# EAGLE schematic GasSensorCentral_v1.0 (EAGLE 7.2.0)
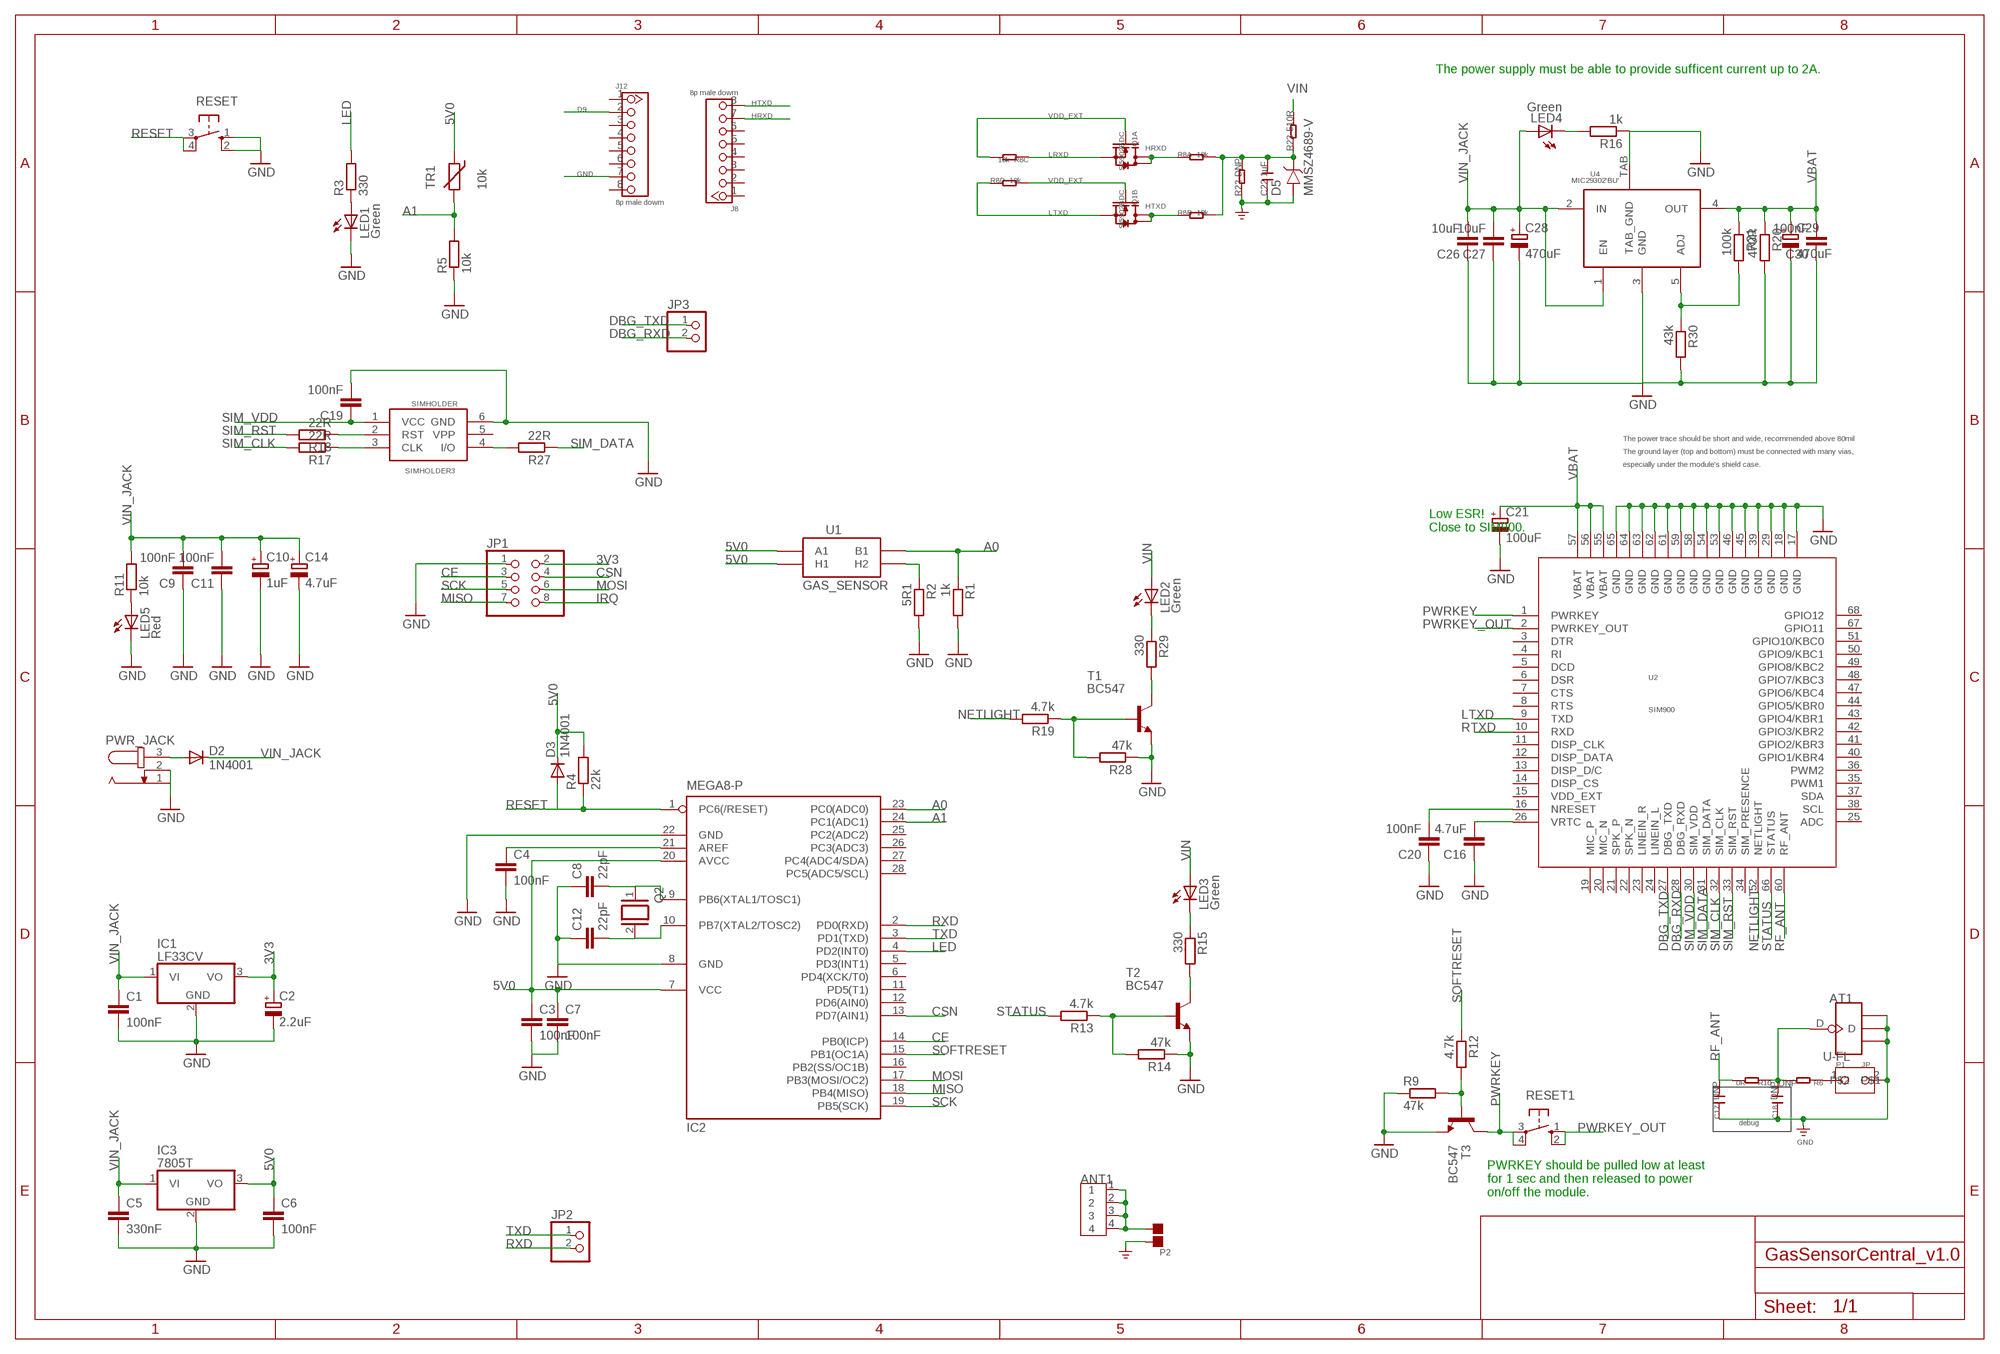
[diagram p0: schematic, sheet 1]

## Parts
ANT1  ANTENNA-SMA-IPX  [SMA-TO-IPX]
AT1  U-FL  ANTENNA-U-FL  [4P-U-FL]
C1  100nF  C-EU025-025X050  [C025-025X050]
C2  2.2uF  CPOL-EUE2.5-5  [E2,5-5]
C3  100nF  C-EU025-025X050  [C025-025X050]
C4  100nF  C-EU025-025X050  [C025-025X050]
C5  330nF  C-EU025-025X050  [C025-025X050]
C6  100nF  C-EU025-025X050  [C025-025X050]
C7  100nF  C-EU025-025X050  [C025-025X050]
C8  22pF  C-EU025-025X050  [C025-025X050]
C9  100nF  C-EU025-025X050  [C025-025X050]
C10  1uF  CPOL-EUE2.5-5  [E2,5-5]
C11  100nF  C-EU025-025X050  [C025-025X050]
C12  22pF  C-EU025-025X050  [C025-025X050]
C14  4.7uF  CPOL-EUE2.5-5  [E2,5-5]
C16  4.7uF  C-EU025-025X050  [C025-025X050]
C17  DNP  C-0402  [0402]
C18  DNP  C-0402  [0402]
C19  100nF  C-EU025-025X050  [C025-025X050]
C20  100nF  C-EU025-025X050  [C025-025X050]
C21  100uF  CPOL-EUE2.5-5  [E2,5-5]
C22  1uF  C-0603  [0603]
C26  10uF  C-EU025-025X050  [C025-025X050]
C27  10uF  C-EU025-025X050  [C025-025X050]
C28  470uF  CPOL-EUE2.5-5  [E2,5-5]
C29  470uF  CPOL-EUE2.5-5  [E2,5-5]
C30  100nF  C-EU025-025X050  [C025-025X050]
D2  1N4001  1N4004  [DO41-10]
D3  1N4001  1N4004  [DO41-10]
D5  MMSZ4689-V  D-VOL'MMSZ4681'  [SOD123-2.7X1.6]
IC1  LF33CV  7805T  [TO220H]
IC2  MEGA8-P  [DIL28-3]
IC3  7805T  [TO220H]
J8  8p male dowm  CK_1X8DD  [CK_1X8]
J12  8p male dowm  CK_1X8DD  [CK_1X8]
JP1  PINHD-2X4  [2X04]
JP2  PINHD-1X2/90  [1X02/90]
JP3  PINHD-1X2/90  [1X02/90]
LED1  Green  LED3MM  [LED3MM]
LED2  Green  LED3MM  [LED3MM]
LED3  Green  LED3MM  [LED3MM]
LED4  Green  LED3MM  [LED3MM]
LED5  Red  LED3MM  [LED3MM]
P1  JP  [JP]
P2  PAD-JUMPER-2P  [2P-SMD-1.78X1.27]
PWR_JACK  JACK-PLUG0  [SPC4077]
Q1  Si5902BDC  010-DUAL-N-MOSFET_1206-8  [1206-8]
Q2  XTAL/S  [QS]
R1  1k  R-EU_0207/10  [0207/10]
R2  5R1  R-EU_0207/10  [0207/10]
R3  330  R-EU_0207/10  [0207/10]
R4  22k  R-EU_0207/10  [0207/10]
R5  10k  R-EU_0207/10  [0207/10]
R6  DNP  R-0402  [0402]
R8  10k  R-4R-1206  [1206-8-3.3X2.4]
R9  47k  R-EU_0207/10  [0207/10]
R10  0R  R-0402  [0402]
R11  10k  R-EU_0207/10  [0207/10]
R12  4.7k  R-EU_0207/10  [0207/10]
R13  4.7k  R-EU_0207/10  [0207/10]
R14  47k  R-EU_0207/10  [0207/10]
R15  330  R-EU_0207/10  [0207/10]
R16  1k  R-EU_0207/10  [0207/10]
R17  22R  R-EU_0207/10  [0207/10]
R18  22R  R-EU_0207/10  [0207/10]
R19  4.7k  R-EU_0207/10  [0207/10]
R20  470R  R-EU_0207/10  [0207/10]
R21  100k  R-EU_0207/10  [0207/10]
R22  DNP  R-0603  [0603]
R23  510R  R-0603  [0603]
R27  22R  R-EU_0207/10  [0207/10]
R28  47k  R-EU_0207/10  [0207/10]
R29  330  R-EU_0207/10  [0207/10]
R30  43k  R-EU_0207/10  [0207/10]
RESET  10-XX  [B3F-10XX]
RESET1  10-XX  [B3F-10XX]
SIMHOLDER  SIMHOLDER3  [SIMHOLDER3]
T1  BC547  [TO92]
T2  BC547  [TO92]
T3  BC547  [TO92]
TR1  10k  THERMISTOR_R-2,5  [RS-2,5]
U1  GAS_SENSOR  [MQ-3]
U2  SIM900  [SIM900]
U4  MIC29302'BU'  [TO-263]

## Nets
3V3: C2.+ IC1.3(VO) JP1.2
5V0: C3.1 C6.1 C7.1 D3.C IC2.7(VCC) IC2.20(AVCC) IC3.3(VO) R4.2 TR1.1 U1.A1 U1.HA(H1)
A0: IC2.23(PC0(ADC0)) R1.1 U1.B1
A1: IC2.24(PC1(ADC1)) R5.2 TR1.2
CE: IC2.14(PB0(ICP)) JP1.3
CSN: IC2.13(PD7(AIN1)) JP1.4
D9: J12.2
DBG_RXD: JP3.2 U2.28(DBG_RXD)
DBG_TXD: JP3.1 U2.27(DBG_TXD)
GND: AT1.GND1 AT1.GND2 AT1.GND3 C1.2 C2.- C3.2 C4.2 C5.2 C6.2 C7.2 C8.1 C9.1 C10.- C11.1 C12.1 C14.- C16.1 C17.1 C18.1 C19.2 C20.1 C21.- C22.1 C26.1 C27.1 C28.- C29.- C30.1 D5.1 IC1.2(GND) IC2.8(GND) IC2.22(GND) IC3.2(GND) J12.7 JP1.1 LED1.K(C) LED5.K(C) P1.2 P2.2 PWR_JACK.1 PWR_JACK.2 R1.2 R2.2 R5.1 R9.1 R14.1 R16.1 R20.2 R22.1 R28.1 R30.2 RESET.1(S) RESET.2(S1) SIMHOLDER.6(GND) T1.1(E) T2.1(E) T3.1(E) U2.17(GND) U2.18(GND) U2.29(GND) U2.39(GND) U2.45(GND) U2.46(GND) U2.53(GND) U2.54(GND) U2.58(GND) U2.59(GND) U2.61(GND) U2.62(GND) U2.63(GND) U2.64(GND) U2.65(GND) U4.3(GND) U4.TAB(TAB_GND)
HRXD: J8.7 Q1.7(A:D) Q1.8(A:D) R8.1
HTXD: J8.8 Q1.5(B:D) Q1.6(B:D) R8.2
IRQ: JP1.8
LED: IC2.4(PD2(INT0)) R3.2
LRXD: Q1.1(A:S) R8.3
LTXD: Q1.3(B:S) R8.4 U2.9(TXD)
MISO: IC2.18(PB4(MISO)) JP1.7
MOSI: IC2.17(PB3(MOSI/OC2)) JP1.6
N$1: C4.1 IC2.21(AREF)
N$3: R2.1 U1.HB(H2)
N$4: D2.A PWR_JACK.3
N$5: LED1.A R3.1
N$6: R27.2 SIMHOLDER.4(I/O)
N$7: LED2.K(C) R29.1
N$8: R29.2 T1.3(C)
N$9: R13.1 R14.2 T2.2(B)
N$10: LED5.A R11.1
N$11: LED3.K(C) R15.1
N$12: R15.2 T2.3(C)
N$13: C20.2 U2.16(NRESET)
N$14: R9.2 R12.2 T3.2(B)
N$15: R19.1 R28.2 T1.2(B)
N$16: R21.2 R30.1 U4.5(ADJ)
N$17: C16.2 U2.26(VRTC)
N$21: AT1.D C18.2 R6.2 R10.1
N$22: P1.1 R6.1
N$23: LED4.K(C) R16.2
N$24: R18.1 SIMHOLDER.2(RST)
N$25: R17.1 SIMHOLDER.3(CLK)
N$29: C8.2 IC2.9(PB6(XTAL1/TOSC1)) Q2.1
N$35: C12.2 IC2.10(PB7(XTAL2/TOSC2)) Q2.2
N$38: C22.2 D5.2 R8.7 R8.8 R22.2 R23.1
N$39: ANT1.1 ANT1.2 ANT1.3 ANT1.4 P2.1
NETLIGHT: R19.2 U2.52(NETLIGHT)
PWRKEY: RESET1.3(P) RESET1.4(P1) T3.3(C) U2.1(PWRKEY)
PWRKEY_OUT: RESET1.1(S) RESET1.2(S1) U2.2(PWRKEY_OUT)
RESET: D3.A IC2.1(PC6(/RESET)) R4.1 RESET.3(P) RESET.4(P1)
RF_ANT: C17.2 R10.2 U2.60(RF_ANT)
RTXD: U2.10(RXD)
RXD: IC2.2(PD0(RXD)) JP2.2
SCK: IC2.19(PB5(SCK)) JP1.5
SIM_CLK: R17.2 U2.32(SIM_CLK)
SIM_DATA: R27.1 U2.31(SIM_DATA)
SIM_RST: R18.2 U2.33(SIM_RST)
SIM_VDD: C19.1 SIMHOLDER.1(VCC) U2.30(SIM_VDD)
SOFTRESET: IC2.15(PB1(OC1A)) R12.1
STATUS: R13.2 U2.66(STATUS)
TXD: IC2.3(PD1(TXD)) JP2.1
VBAT: C21.+ C29.+ C30.2 R20.1 R21.1 U2.55(VBAT) U2.56(VBAT) U2.57(VBAT) U4.4(OUT)
VDD_EXT: Q1.2(A:G) Q1.4(B:G) R8.5 R8.6
VIN: LED2.A LED3.A R23.2
VIN_JACK: C1.1 C5.1 C9.2 C10.+ C11.2 C14.+ C26.2 C27.2 C28.+ D2.C IC1.1(VI) IC3.1(VI) LED4.A R11.2 U4.1(EN) U4.2(IN)
Unconnected: IC2.5(PD3(INT1)) IC2.6(PD4(XCK/T0)) IC2.11(PD5(T1)) IC2.12(PD6(AIN0)) IC2.16(PB2(SS/OC1B)) IC2.25(PC2(ADC2)) IC2.26(PC3(ADC3)) IC2.27(PC4(ADC4/SDA)) IC2.28(PC5(ADC5/SCL)) J8.1 J8.2 J8.3 J8.4 J8.5 J8.6 J12.1 J12.3 J12.4 J12.5 J12.6 J12.8 SIMHOLDER.5(VPP) U2.3(DTR) U2.4(RI) U2.5(DCD) U2.6(DSR) U2.7(CTS) U2.8(RTS) U2.11(DISP_CLK) U2.12(DISP_DATA) U2.13(DISP_D/C) U2.14(DISP_CS) U2.15(VDD_EXT) U2.19(MIC_P) U2.20(MIC_N) U2.21(SPK_P) U2.22(SPK_N) U2.23(LINEIN_R) U2.24(LINEIN_L) U2.25(ADC) U2.34(SIM_PRESENCE) U2.35(PWM1) U2.36(PWM2) U2.37(SDA) U2.38(SCL) U2.40(GPIO1/KBR4) U2.41(GPIO2/KBR3) U2.42(GPIO3/KBR2) U2.43(GPIO4/KBR1) U2.44(GPIO5/KBR0) U2.47(GPIO6/KBC4) U2.48(GPIO7/KBC3) U2.49(GPIO8/KBC2) U2.50(GPIO9/KBC1) U2.51(GPIO10/KBC0) U2.67(GPIO11) U2.68(GPIO12)

## Notes on the sheet
- The power supply must be able to provide sufficent current up to 2A.
- The power trace should be short and wide, recommended above 80mil
- The ground layer (top and bottom) must be connected with many vias,
- especially under the module's shield case.
- Low ESR!
  Close to SIM900.
- debug
- PWRKEY should be pulled low at least 
  for 1 sec and then released to power 
  on/off the module.

## Library data of the parts
ANT1 = Connector:ANTENNA-SMA-IPX
AT1 = Connector:ANTENNA-U-FL
C1 C3-C9 C11 C12 C16 C19 C20 C26 C27 C30 = rcl:C-EU: CAPACITOR, European symbol
C2 C10 C14 C21 C28 C29 = rcl:CPOL-EU: POLARIZED CAPACITOR, European symbol
C17 C18 C22 = discrete:C*: Ceramic Capacitors
D2 D3 = diode:1N4004: DIODE general purpose rectifier, 1 A
D5 = template:D-VOL
IC1 IC3 = linear:78*: Positive VOLTAGE REGULATOR Source: http://cache.national.com/ds/LM/LM78L05.pdf http://www.fairchildsemi.com/ds/LM/LM7805.pdf
IC2 = atmel:MEGA8-P: MICROCONTROLLER 8 Kbytes FLASH, 1 kbytes SRAM, 512 bytes EEPROM, USART, 4-channel 10 bit ADC, 2-channel 8 bit ADC Pin compatible with Atmega48, ATMega88, ATMega168 Source: avr.lbr; OC_FARNELL: unknown; OC_NEWARK: unknown
J8 J12 = CONNECTER:CK_1X8
JP1 = pinhead:PINHD-2X4: PIN HEADER
JP2 JP3 = pinhead:PINHD-1X2: PIN HEADER
LED1-LED5 = led:LED: LED OSRAM: - CHIPLED LG R971, LG N971, LY N971, LG Q971, LY Q971, LO R971, LY R971 LH N974, LH R974 LS Q976, LO Q976, LY Q976 LO Q996 - Hyper CHIPLED LW Q18S LB Q993, LB Q99A, LB R99A - SideLED LS A670, LO A670, LY A670, LG A670, LP A670 LB A673, LV A673, LT A673, LW A673 LH A674 LY A675 LS A676, LA A676, LO A676, LY A676, LW A676 LS A679, LY A679, LG A679 - Hyper Micro SIDELED® LS Y876, LA Y876, LO Y876, LY Y876 LT Y87S - SmartLED LW L88C, LW L88S LB L89C, LB L89S, LG L890 LS L89K, LO L89K, LY L89K LS L896, LA L896, LO L896, LY L896 - TOPLED LS T670, LO T670, LY T670, LG T670, LP T670 LSG T670, LSP T670, LSY T670, LOP T670, LYG T670 LG T671, LOG T671, LSG T671 LB T673, LV T673, LT T673, LW T673 LH T674 LS T676, LA T676, LO T676, LY T676, LB T676, LH T676, LSB T676, LW T676 LB T67C, LV T67C, LT T67C, LS T67K, LO T67K, LY T67K, LW E67C LS E67B, LA E67B, LO E67B, LY E67B, LB E67C, LV E67C, LT E67C LW T67C LS T679, LY T679, LG T679 LS T770, LO T770, LY T770, LG T770, LP T770 LB T773, LV T773, LT T773, LW T773 LH T774 LS E675, LA E675, LY E675, LS T675 LS T776, LA T776, LO T776, LY T776, LB T776 LHGB T686 LT T68C, LB T68C - Hyper Mini TOPLED® LB M676 - Mini TOPLED Santana® LG M470 LS M47K, LO M47K, LY M47K Source: http://www.osram.convergy.de LUXEON: - LUMILED® LXK2-PW12-R00, LXK2-PW12-S00, LXK2-PW14-U00, LXK2-PW14-V00 LXK2-PM12-R00, LXK2-PM12-S00, LXK2-PM14-U00 LXK2-PE12-Q00, LXK2-PE12-R00, LXK2-PE12-S00, LXK2-PE14-T00, LXK2-PE14-U00 LXK2-PB12-K00, LXK2-PB12-L00, LXK2-PB12-M00, LXK2-PB14-N00, LXK2-PB14-P00, LXK2-PB14-Q00 LXK2-PR12-L00, LXK2-PR12-M00, LXK2-PR14-Q00, LXK2-PR14-R00 LXK2-PD12-Q00, LXK2-PD12-R00, LXK2-PD12-S00 LXK2-PH12-R00, LXK2-PH12-S00 LXK2-PL12-P00, LXK2-PL12-Q00, LXK2-PL12-R00 Source: www.luxeon.com KINGBRIGHT: KA-3528ASYC Source: www.kingbright.com
P1 = mySeeed:JP
P2 = discrete:PAD-JUMPER-2P; PARTNO: DNP
PWR_JACK = con-jack:JACK-PLUG: DC POWER JACK Power Jack, DC, Right Angle, Through Hole, Rated 5A at 16VDC, PC Terminals Distributor: Farnell (www.Farnell.de) Drawing: 84N1161.pdf / 84N1162.pdf Manufacturer: SPC Technology (www.spctechnology.com) Type: SPC4077 / SPC 4078; OC_FARNELL: unknown; OC_NEWARK: unknown
Q1 = discrete:010-DUAL-N-MOSFET*: Si5902BDC Si5904DC Si5908DC Si5920DC
Q2 = special:XTAL/S: CRYSTAL
R1-R5 R9 R11-R21 R27-R30 = rcl:R-EU_: RESISTOR, European symbol
R6 R10 R22 R23 = discrete:R*
R8 = discrete:R-4R*: Resistor Array
RESET RESET1 = switch-omron:10-XX: OMRON SWITCH; MPN: B3F-1000; OC_FARNELL: 176432; OC_NEWARK: 36M3542
SIMHOLDER = SparkFun2:SIMHOLDER3
T1-T3 = transistor:BC547: NPN TRANSISTOR
TR1 = discrete:THERMISTOR_: Thermo Resistor
U1 = SparkFun-Sensors:GAS_SENSOR: MQ-3 alcohol gas sensor . FP not tested. SEN-08880.
U2 = ICs_v54:SIM900
U4 = ICs_v54:MIC29302